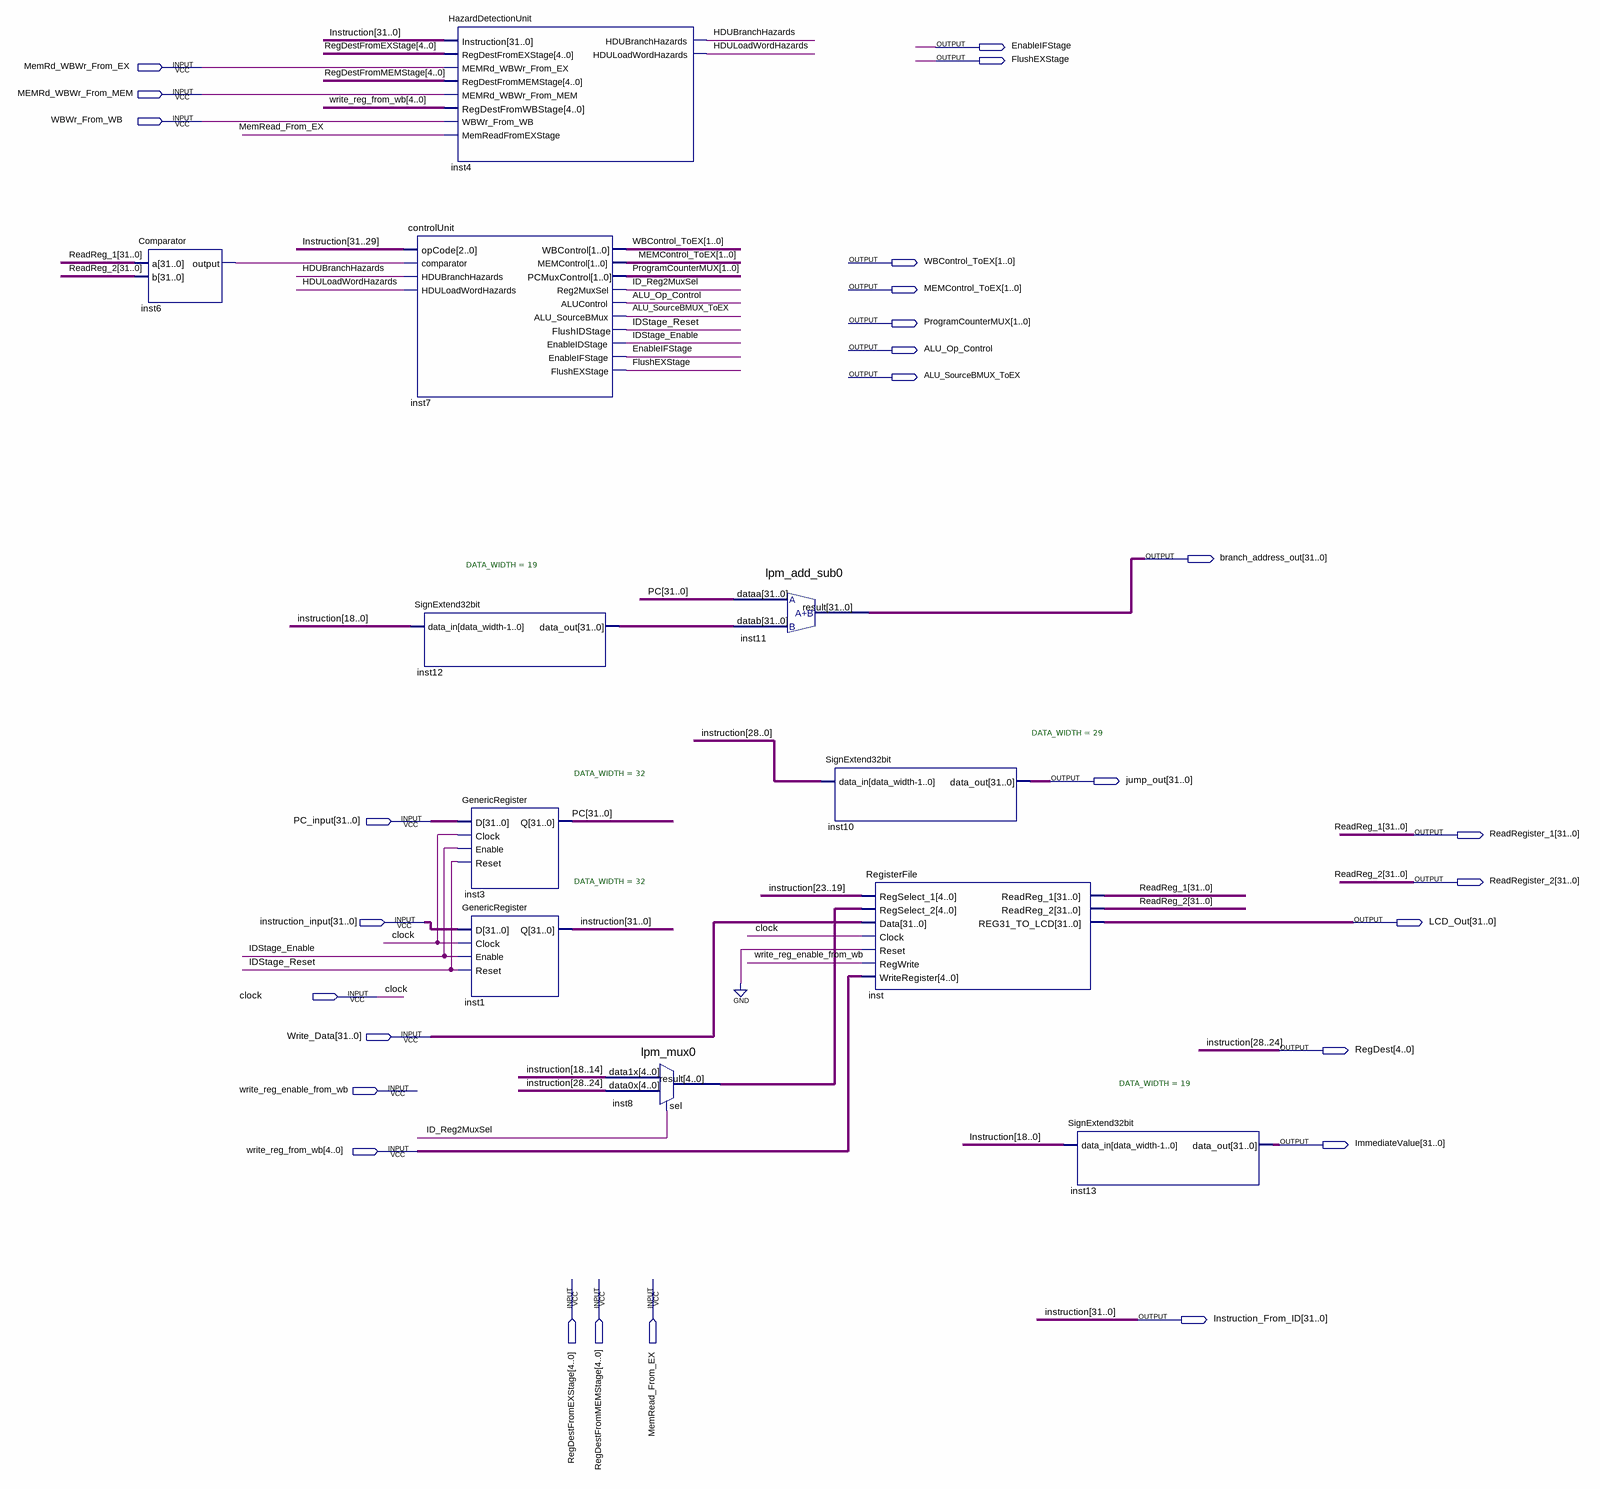
[diagram p0: schematic sheet]
// Quartus schematic DecodeStage.bdf as structural Verilog: 11 symbols, 27 pins
module DecodeStage (
  input  MemRd_WBWr_From_EX,
  input  MEMRd_WBWr_From_MEM,
  input  WBWr_From_WB,
  input  [31:0] PC_input,
  input  [31:0] instruction_input,
  input  clock,
  input  [31:0] Write_Data,
  input  write_reg_enable_from_wb,
  input  [4:0] write_reg_from_wb,
  input  [4:0] RegDestFromEXStage,
  input  [4:0] RegDestFromMEMStage,
  input  MemRead_From_EX,
  output EnableIFStage,
  output FlushEXStage,
  output [1:0] WBControl_ToEX,
  output [1:0] MEMControl_ToEX,
  output [1:0] ProgramCounterMUX,
  output ALU_Op_Control,
  output ALU_SourceBMUX_ToEX,
  output [31:0] branch_address_out,
  output [31:0] jump_out,
  output [31:0] ReadRegister_1,
  output [31:0] ReadRegister_2,
  output [31:0] LCD_Out,
  output [4:0] RegDest,
  output [31:0] ImmediateValue,
  output [31:0] Instruction_From_ID
);

  wire HDUBranchHazards, HDULoadWordHazards, ID_Reg2MuxSel, IDStage_Enable, IDStage_Reset, inst6_output;
  wire [4:0] inst8_result;
  wire [31:0] inst12_data_out, PC;

  Comparator inst6 (.a(ReadRegister_1), .b(ReadRegister_2), .\output (inst6_output));
  HazardDetectionUnit inst4 (
    .Instruction(Instruction_From_ID), .RegDestFromEXStage(RegDestFromEXStage),
    .MEMRd_WBWr_From_EX(MemRd_WBWr_From_EX), .RegDestFromMEMStage(RegDestFromMEMStage),
    .MEMRd_WBWr_From_MEM(MEMRd_WBWr_From_MEM), .RegDestFromWBStage(write_reg_from_wb),
    .WBWr_From_WB(WBWr_From_WB), .MemReadFromEXStage(MemRead_From_EX), .HDUBranchHazards(HDUBranchHazards),
    .HDULoadWordHazards(HDULoadWordHazards));
  controlUnit inst7 (
    .opCode(Instruction_From_ID[31:29]), .comparator(inst6_output), .HDUBranchHazards(HDUBranchHazards),
    .HDULoadWordHazards(HDULoadWordHazards), .WBControl(WBControl_ToEX), .MEMControl(MEMControl_ToEX),
    .PCMuxControl(ProgramCounterMUX), .Reg2MuxSel(ID_Reg2MuxSel), .ALUControl(ALU_Op_Control),
    .ALU_SourceBMux(ALU_SourceBMUX_ToEX), .FlushIDStage(IDStage_Reset), .EnableIDStage(IDStage_Enable),
    .EnableIFStage(EnableIFStage), .FlushEXStage(FlushEXStage));
  SignExtend32bit #(.DATA_WIDTH(19)) inst12 (.data_in(Instruction_From_ID[18:0]), .data_out(inst12_data_out));
  GenericRegister #(.DATA_WIDTH(32)) inst3 (
    .D(PC_input), .Clock(clock), .Enable(IDStage_Enable), .Reset(IDStage_Reset), .Q(PC));
  GenericRegister #(.DATA_WIDTH(32)) inst1 (
    .D(instruction_input), .Clock(clock), .Enable(IDStage_Enable), .Reset(IDStage_Reset),
    .Q(Instruction_From_ID));
  lpm_mux0 inst8 (
    .data1x(Instruction_From_ID[18:14]), .data0x(Instruction_From_ID[28:24]), .sel(ID_Reg2MuxSel),
    .result(inst8_result));
  lpm_add_sub0 inst11 (.dataa(PC), .datab(inst12_data_out), .result(branch_address_out));
  SignExtend32bit #(.DATA_WIDTH(29)) inst10 (.data_in(Instruction_From_ID[28:0]), .data_out(jump_out));
  RegisterFile inst (
    .RegSelect_1(Instruction_From_ID[23:19]), .RegSelect_2(inst8_result), .Data(Write_Data), .Clock(clock),
    .Reset(1'b0), .RegWrite(write_reg_enable_from_wb), .WriteRegister(write_reg_from_wb),
    .ReadReg_1(ReadRegister_1), .ReadReg_2(ReadRegister_2), .REG31_TO_LCD(LCD_Out));
  SignExtend32bit #(.DATA_WIDTH(19)) inst13 (.data_in(Instruction_From_ID[18:0]), .data_out(ImmediateValue));

  assign RegDest = Instruction_From_ID[28:24];

  // Other names for the same wires on the sheet: instruction[31:0] = Instruction_From_ID;
  //   ReadReg_1[31:0] = ReadRegister_1; ReadReg_2[31:0] = ReadRegister_2
endmodule
